# EAGLE schematic PCB_schematic (EAGLE 9.6.2)
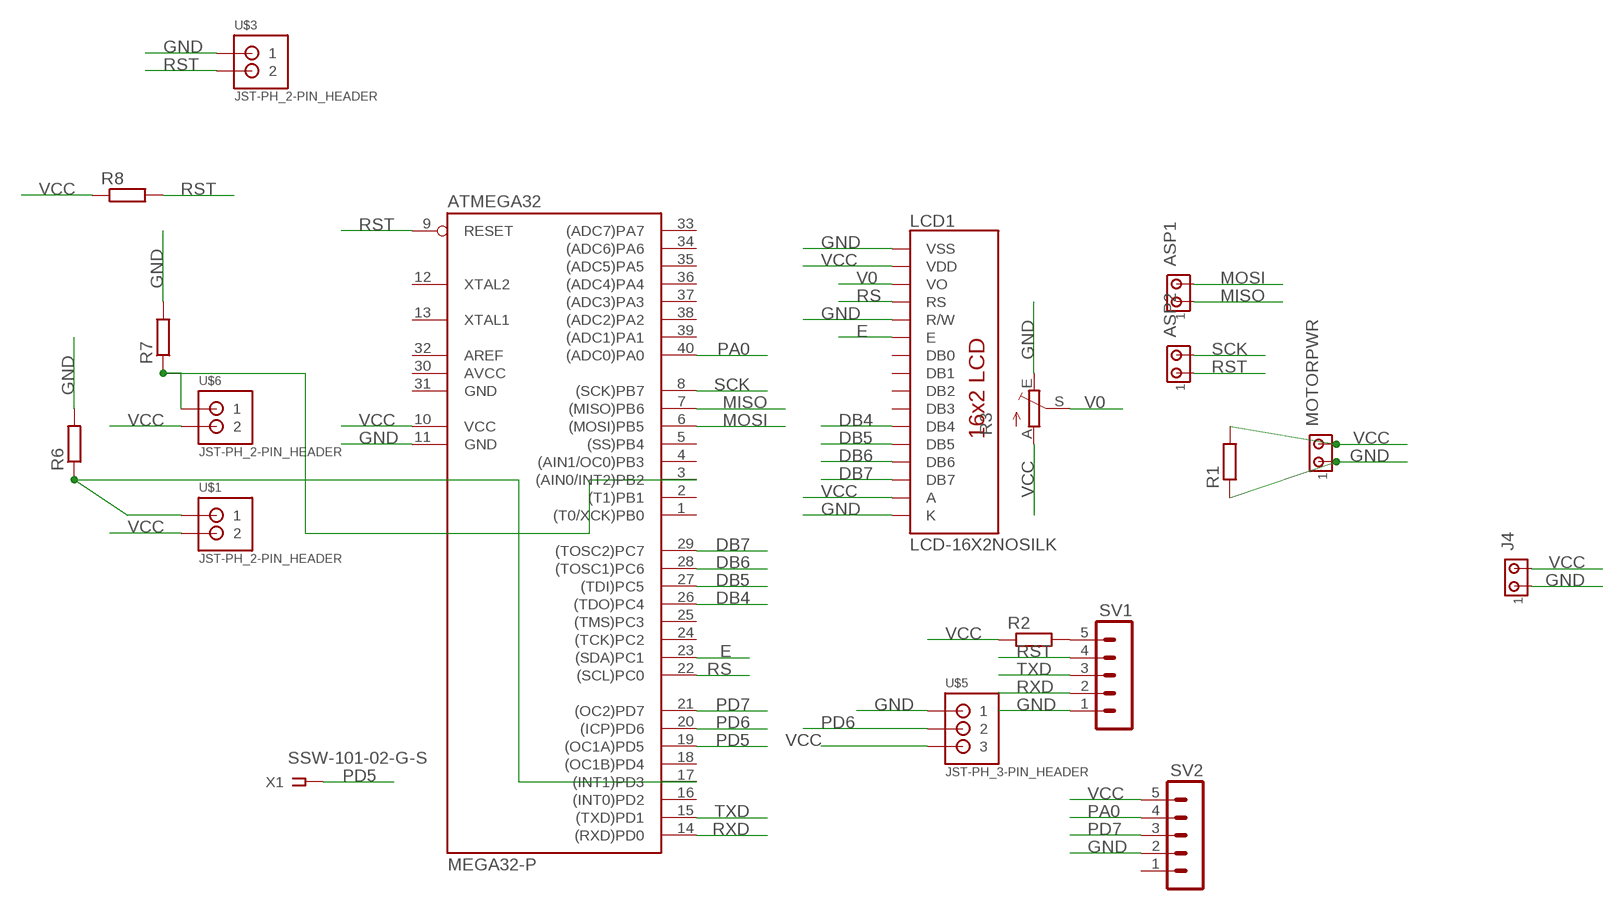
[diagram p0: schematic, sheet 1]

## Parts
ASP1  MTA02-100  [10X02MTA]
ASP2  MTA02-100  [10X02MTA]
ATMEGA32  MEGA32-P  [DIL40]
J4  MTA02-100  [10X02MTA]
LCD1  LCD-16X2NOSILK  [LCD-16X2_NOSILK]
MOTORPWR  MTA02-100  [10X02MTA]
R1  R-EU_0204/7  [0204/7]
R2  R-EU_0204/7  [0204/7]
R3  TRIM_EU-CA6V  [CA6V]
R6  R-EU_0204/7  [0204/7]
R7  R-EU_0204/7  [0204/7]
R8  R-EU_0204/7  [0204/7]
SV1  MA05-1  [MA05-1]
SV2  MA05-1  [MA05-1]
U$1  JST-PH_2-PIN_HEADER  [JST_B2B-PH_HEADER]
U$3  JST-PH_2-PIN_HEADER  [JST_B2B-PH_HEADER]
U$5  JST-PH_3-PIN_HEADER  [JST_B3B-PH_HEADER]
U$6  JST-PH_2-PIN_HEADER  [JST_B2B-PH_HEADER]
X1  SSW-101-02-G-S  [SSW-101-02-G-S]

## Nets
DB4: ATMEGA32.26((TDO)PC4) LCD1.11(DB4)
DB5: ATMEGA32.27((TDI)PC5) LCD1.12(DB5)
DB6: ATMEGA32.28((TOSC1)PC6) LCD1.13(DB6)
DB7: ATMEGA32.29((TOSC2)PC7) LCD1.14(DB7)
E: ATMEGA32.23((SDA)PC1) LCD1.6(E)
GND: ATMEGA32.11(GND) J4.1 LCD1.1(VSS) LCD1.5(R/W) LCD1.16(K) MOTORPWR.1 R1.1 R3.E R6.2 R7.2 SV1.1 SV2.2 U$3.P1 U$5.P1
MISO: ASP1.1 ATMEGA32.7((MISO)PB6)
MOSI: ASP1.2 ATMEGA32.6((MOSI)PB5)
N$3: R2.2 SV1.5
N$15: ATMEGA32.3((AIN0/INT2)PB2) R7.1 U$6.P1
N$19: ATMEGA32.17((INT1)PD3) R6.1 U$1.P1
PA0: ATMEGA32.40((ADC0)PA0) SV2.4
PD5: ATMEGA32.19((OC1A)PD5) X1.1
PD6: ATMEGA32.20((ICP)PD6) U$5.P2
PD7: ATMEGA32.21((OC2)PD7) SV2.3
RS: ATMEGA32.22((SCL)PC0) LCD1.4(RS)
RST: ASP2.1 ATMEGA32.9(RESET) R8.2 SV1.4 U$3.P2
RXD: ATMEGA32.14((RXD)PD0) SV1.2
SCK: ASP2.2 ATMEGA32.8((SCK)PB7)
TXD: ATMEGA32.15((TXD)PD1) SV1.3
V0: LCD1.3(VO) R3.S
VCC: ATMEGA32.10(VCC) J4.2 LCD1.2(VDD) LCD1.15(A) MOTORPWR.2 R1.2 R2.1 R3.A R8.1 SV2.5 U$1.P2 U$5.P3 U$6.P2
Unconnected: ATMEGA32.1((T0/XCK)PB0) ATMEGA32.2((T1)PB1) ATMEGA32.4((AIN1/OC0)PB3) ATMEGA32.5((SS)PB4) ATMEGA32.12(XTAL2) ATMEGA32.13(XTAL1) ATMEGA32.16((INT0)PD2) ATMEGA32.18((OC1B)PD4) ATMEGA32.24((TCK)PC2) ATMEGA32.25((TMS)PC3) ATMEGA32.32(AREF) ATMEGA32.33((ADC7)PA7) ATMEGA32.34((ADC6)PA6) ATMEGA32.35((ADC5)PA5) ATMEGA32.36((ADC4)PA4) ATMEGA32.37((ADC3)PA3) ATMEGA32.38((ADC2)PA2) ATMEGA32.39((ADC1)PA1) LCD1.7(DB0) LCD1.8(DB1) LCD1.9(DB2) LCD1.10(DB3) SV2.1

## Power pins joined to a net without a drawn wire
AVCC: ATMEGA32.30(AVCC)
GND: ATMEGA32.31(GND)

## Library data of the parts
ASP1 ASP2 J4 MOTORPWR = con-amp:MTA02-100: AMP connector
ATMEGA32 = atmel:MEGA32-P: MICROCONTROLLER 32 Kbytes FLASH 2 Kbytes SRAM 1 Kbytes EEPROM USART 8-channel 10 bit ADC Source: www.atmel.com .. doc2503.pdf; MPN: ATMEGA32-16PU; OC_FARNELL: 1661729; OC_NEWARK: 51P1794
LCD1 = SparkFun-Displays:LCD-16X2: Standard text-only 16x2 parallel input LCD Basic 16 character by 2 line display. Typically utilizes the extremely common HD44780 parallel interface chipset SparkFun Products: Basic 16x2 Green <https://www.sparkfun.com/products/255> Basic 8x2 Green <https://www.sparkfun.com/products/11122>; SF_ID: LCD-00255
R1 R2 R6-R8 = rcl:R-EU_: RESISTOR, European symbol; SPICEPREFIX: R
R3 = pot:TRIM_EU-: POTENTIOMETER
SV1 SV2 = con-lstb:MA05-1: PIN HEADER; OC_FARNELL: unknown; OC_NEWARK: unknown
U$1 U$3 U$6 = srg:JST-PH_2-PIN_HEADER: 2-pin JST PH Shrouded Header, top entry P/N B2B-PH-K-S Mating connector PHR-2 Mating cable assembly: Sparkfun PRT-09914 <http://www.sparkfun.com/products/9914>
U$5 = srg:JST-PH_3-PIN_HEADER: 3-pin JST PH Shrouded Header, top entry P/N B3B-PH-K-S Mating connector PHR-3; JST: 3
X1 = con-samtec:SSW-101-02-G-S: THROUGH-HOLE .025" SQ POST SOCKET Source: Samtec SSW.pdf; MF: Samtec Inc.; MPN: SSW-101-02-G-S; OC_FARNELL: unknown; OC_NEWARK: 11P9336